# EAGLE design ink_shield_nozzle-test_v3 (EAGLE 6.6.0)
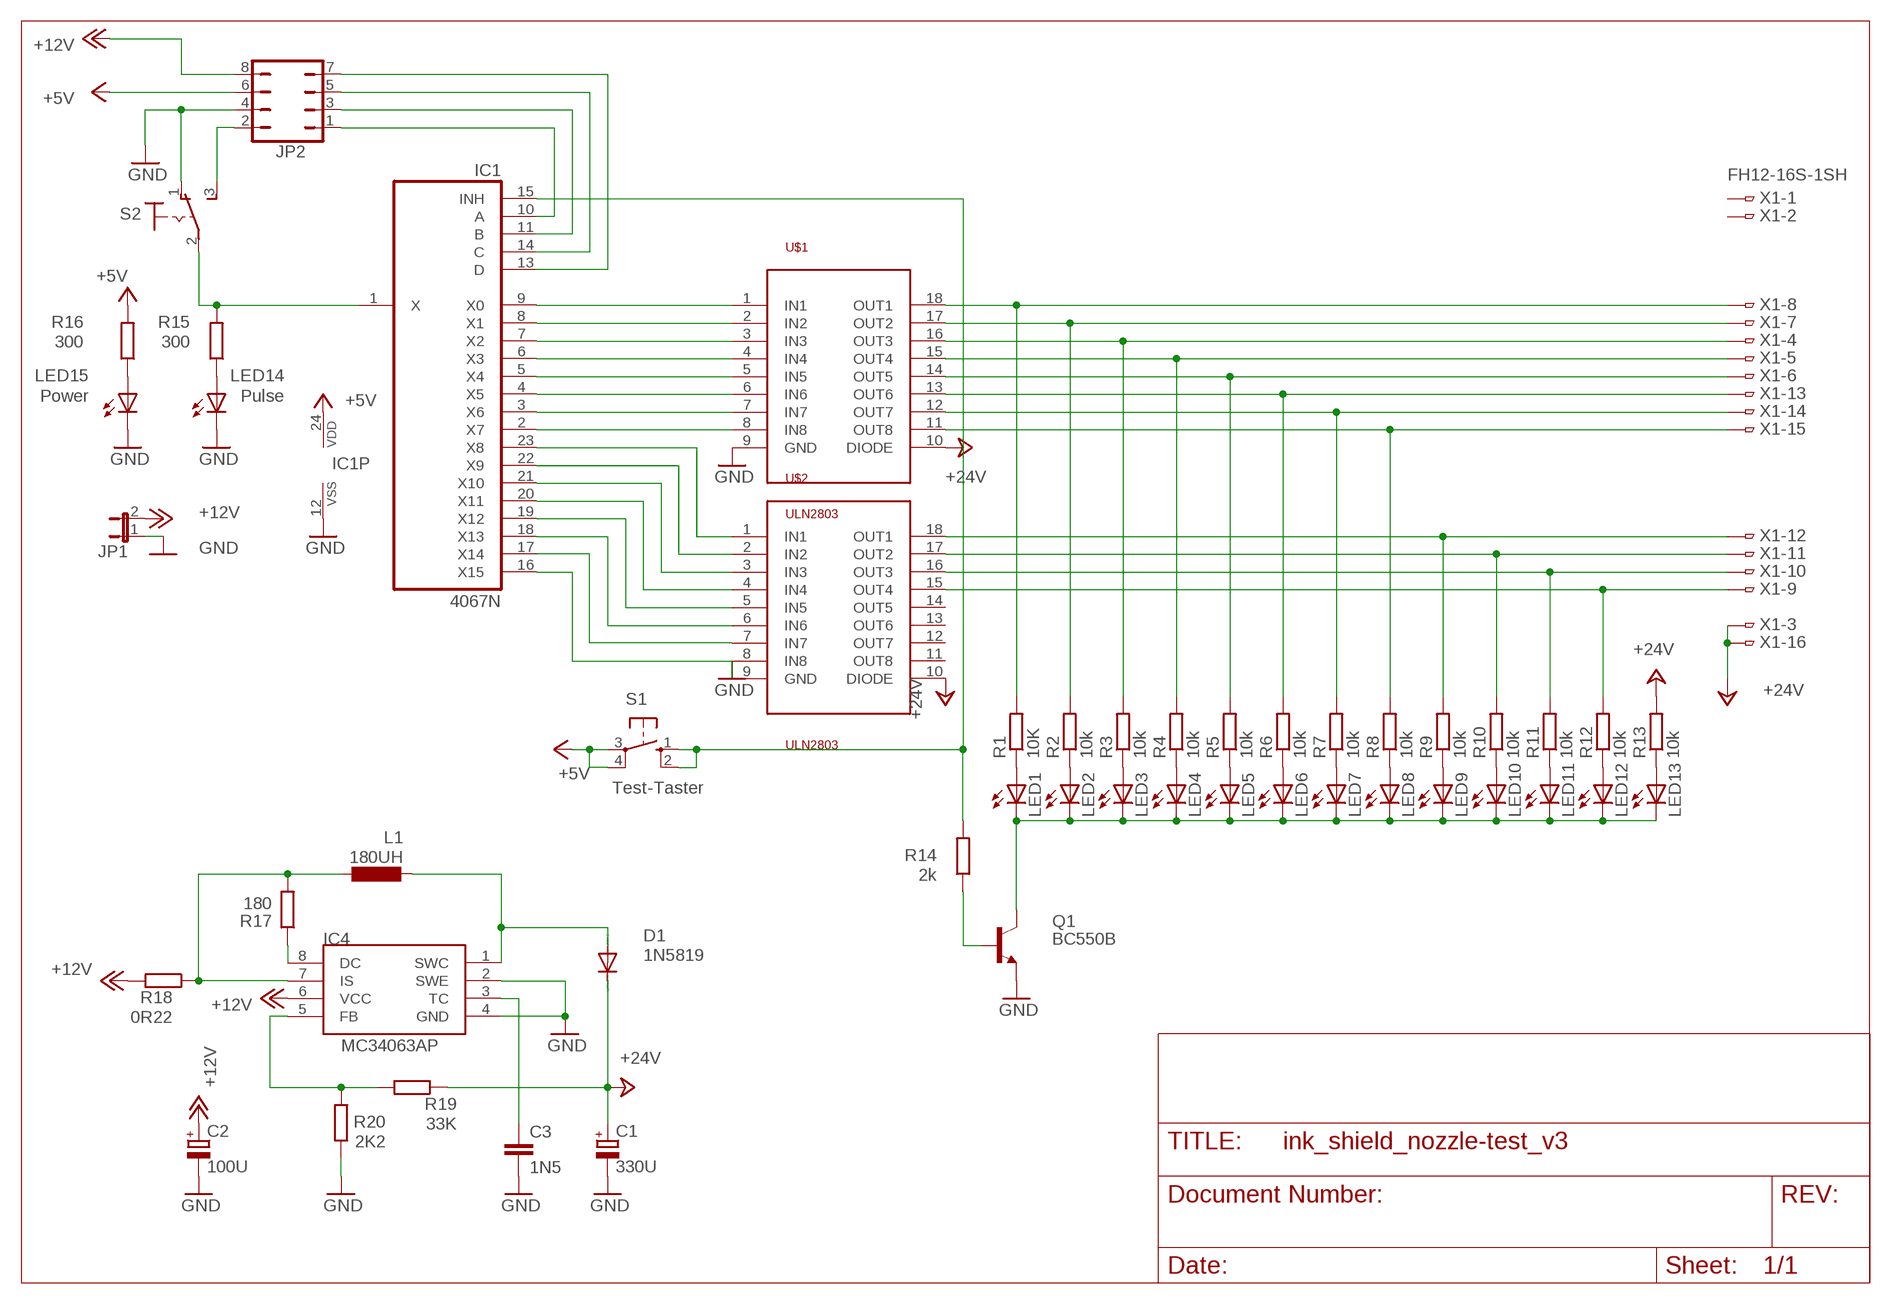
[diagram p0: schematic, sheet 1]

## Parts
C1  330U  CPOL-EUE3.5-10  [E3,5-10]
C2  100U  CPOL-EUE2.5-6  [E2,5-6]
C3  1N5  C-EU025-024X044  [C025-024X044]
D1  1N5819  1N4148DO35-10  [DO35-10]
IC1  4067N  [DIL24-6]
IC4  MC34063AP  [DIL08]
JP1  JP1E  [JP1]
JP2  JP4Q  [JP4Q]
L1  180UH  L-EU6000-XXX-RC  [6000-XXXX-RC]
LED1  LEDCHIPLED_0603  [CHIPLED_0603]
LED2  LEDCHIPLED_0603  [CHIPLED_0603]
LED3  LEDCHIPLED_0603  [CHIPLED_0603]
LED4  LEDCHIPLED_0603  [CHIPLED_0603]
LED5  LEDCHIPLED_0603  [CHIPLED_0603]
LED6  LEDCHIPLED_0603  [CHIPLED_0603]
LED7  LEDCHIPLED_0603  [CHIPLED_0603]
LED8  LEDCHIPLED_0603  [CHIPLED_0603]
LED9  LEDCHIPLED_0603  [CHIPLED_0603]
LED10  LEDCHIPLED_0603  [CHIPLED_0603]
LED11  LEDCHIPLED_0603  [CHIPLED_0603]
LED12  LEDCHIPLED_0603  [CHIPLED_0603]
LED13  LEDCHIPLED_0603  [CHIPLED_0603]
LED14  Pulse  LED3MM  [LED3MM]
LED15  Power  LED3MM  [LED3MM]
Q1  BC550B  [TO92-EBC]
R1  10K  R-EU_M1206  [M1206]
R2  10k  R-EU_M1206  [M1206]
R3  10k  R-EU_M1206  [M1206]
R4  10k  R-EU_M1206  [M1206]
R5  10k  R-EU_M1206  [M1206]
R6  10k  R-EU_M1206  [M1206]
R7  10k  R-EU_M1206  [M1206]
R8  10k  R-EU_M1206  [M1206]
R9  10k  R-EU_M1206  [M1206]
R10  10k  R-EU_M1206  [M1206]
R11  10k  R-EU_M1206  [M1206]
R12  10k  R-EU_M1206  [M1206]
R13  10k  R-EU_M1206  [M1206]
R14  2k  R-EU_M3216  [M3216]
R15  300  R-EU_0207/10  [0207/10]
R16  300  R-EU_0207/10  [0207/10]
R17  180  R-EU_0207/12  [0207/12]
R18  0R22  R-EU_0207/12  [0207/12]
R19  33K  R-EU_0207/12  [0207/12]
R20  2K2  R-EU_0207/10  [0207/10]
S1  Test-Taster  10-XX  [B3F-10XX]
S2  M9040P  [M9040P]
U$1  ULN2803  [SO18L]
U$2  ULN2803  [SO18L]
X1  FH12-16S-1SH  [FH12-16S-1SH]

## Nets
+5V: IC1.24(VDD) JP2.6 R16.2 S1.3(P) S1.4(P1)
+12V: C2.+ IC4.6(VCC) JP1.2 JP2.8 R18.2
+24V: C1.+ D1.C R13.2 R19.1 U$1.10(DIODE) U$2.10(DIODE) X1.3 X1.16
GND: C1.- C2.- C3.2 IC1.12(VSS) IC4.2(SWE) IC4.4(GND) JP1.1 JP2.4 LED14.K(C) LED15.K(C) Q1.E R20.1 S2.1(O) U$1.9(GND) U$2.9(GND)
N$1: IC1.9(X0) U$1.1(IN1)
N$2: IC1.8(X1) U$1.2(IN2)
N$3: IC1.7(X2) U$1.3(IN3)
N$4: IC1.6(X3) U$1.4(IN4)
N$5: IC1.5(X4) U$1.5(IN5)
N$6: IC1.4(X5) U$1.6(IN6)
N$7: IC1.3(X6) U$1.7(IN7)
N$8: IC1.2(X7) U$1.8(IN8)
N$9: IC1.23(X8) U$2.1(IN1)
N$10: IC1.22(X9) U$2.2(IN2)
N$11: IC1.21(X10) U$2.3(IN3)
N$12: IC1.20(X11) U$2.4(IN4)
N$13: IC1.19(X12) U$2.5(IN5)
N$14: IC1.18(X13) U$2.6(IN6)
N$15: IC1.17(X14) U$2.7(IN7)
N$16: IC1.16(X15) U$2.8(IN8)
N$17: LED1.A R1.1
N$18: LED2.A R2.1
N$19: LED3.A R3.1
N$20: LED4.A R4.1
N$21: LED5.A R5.1
N$22: LED6.A R6.1
N$23: LED7.A R7.1
N$24: LED8.A R8.1
N$25: LED9.A R9.1
N$26: LED10.A R10.1
N$27: LED11.A R11.1
N$28: LED12.A R12.1
N$29: LED1.C LED2.C LED3.C LED4.C LED5.C LED6.C LED7.C LED8.C LED9.C LED10.C LED11.C LED12.C LED13.C Q1.C
N$30: R1.2 U$1.18(OUT1) X1.8
N$31: R2.2 U$1.17(OUT2) X1.7
N$32: R3.2 U$1.16(OUT3) X1.4
N$33: R4.2 U$1.15(OUT4) X1.5
N$34: R5.2 U$1.14(OUT5) X1.6
N$35: R6.2 U$1.13(OUT6) X1.13
N$36: R7.2 U$1.12(OUT7) X1.14
N$37: R8.2 U$1.11(OUT8) X1.15
N$38: R9.2 U$2.18(OUT1) X1.12
N$39: R10.2 U$2.17(OUT2) X1.11
N$40: R11.2 U$2.16(OUT3) X1.10
N$41: R12.2 U$2.15(OUT4) X1.9
N$42: LED13.A R13.1
N$43: IC1.15(INH) R14.2 S1.1(S) S1.2(S1)
N$44: Q1.B R14.1
N$45: LED14.A R15.1
N$46: IC1.10(A) JP2.1
N$47: IC1.11(B) JP2.3
N$48: IC1.14(C) JP2.5
N$49: IC1.13(D) JP2.7
N$50: IC1.1(X) R15.2 S2.2(P)
N$51: LED15.A R16.1
N$52: IC4.7(IS) L1.1 R17.2 R18.1
N$53: D1.A IC4.1(SWC) L1.2
N$55: IC4.8(DC) R17.1
N$56: C3.1 IC4.3(TC)
N$57: IC4.5(FB) R19.2 R20.2
N$58: JP2.2 S2.3(S)
Unconnected: U$2.11(OUT8) U$2.12(OUT7) U$2.13(OUT6) U$2.14(OUT5) X1.1 X1.2

## Library data of the parts
C1 C2 = rcl:CPOL-EU: POLARIZED CAPACITOR, European symbol
C3 = rcl:C-EU: CAPACITOR, European symbol
D1 = diode:1N4148: DIODE high speed (Philips)
IC1 = 40xx:4067: 16-channel ANALOG MULTIPLEXER
IC4 = mc34063:MC34063
JP1 = jumper:JP1E: JUMPER
JP2 = jumper:JP4Q: JUMPER
L1 = rcl:L-EU: INDUCTOR, European symbol
LED1-LED15 = led:LED: LED OSRAM: - CHIPLED LG R971, LG N971, LY N971, LG Q971, LY Q971, LO R971, LY R971 LH N974, LH R974 LS Q976, LO Q976, LY Q976 LO Q996 - Hyper CHIPLED LW Q18S LB Q993, LB Q99A, LB R99A - SideLED LS A670, LO A670, LY A670, LG A670, LP A670 LB A673, LV A673, LT A673, LW A673 LH A674 LY A675 LS A676, LA A676, LO A676, LY A676, LW A676 LS A679, LY A679, LG A679 - Hyper Micro SIDELED® LS Y876, LA Y876, LO Y876, LY Y876 LT Y87S - SmartLED LW L88C, LW L88S LB L89C, LB L89S, LG L890 LS L89K, LO L89K, LY L89K LS L896, LA L896, LO L896, LY L896 - TOPLED LS T670, LO T670, LY T670, LG T670, LP T670 LSG T670, LSP T670, LSY T670, LOP T670, LYG T670 LG T671, LOG T671, LSG T671 LB T673, LV T673, LT T673, LW T673 LH T674 LS T676, LA T676, LO T676, LY T676, LB T676, LH T676, LSB T676, LW T676 LB T67C, LV T67C, LT T67C, LS T67K, LO T67K, LY T67K, LW E67C LS E67B, LA E67B, LO E67B, LY E67B, LB E67C, LV E67C, LT E67C LW T67C LS T679, LY T679, LG T679 LS T770, LO T770, LY T770, LG T770, LP T770 LB T773, LV T773, LT T773, LW T773 LH T774 LS E675, LA E675, LY E675, LS T675 LS T776, LA T776, LO T776, LY T776, LB T776 LHGB T686 LT T68C, LB T68C - Hyper Mini TOPLED® LB M676 - Mini TOPLED Santana® LG M470 LS M47K, LO M47K, LY M47K Source: http://www.osram.convergy.de LUXEON: - LUMILED® LXK2-PW12-R00, LXK2-PW12-S00, LXK2-PW14-U00, LXK2-PW14-V00 LXK2-PM12-R00, LXK2-PM12-S00, LXK2-PM14-U00 LXK2-PE12-Q00, LXK2-PE12-R00, LXK2-PE12-S00, LXK2-PE14-T00, LXK2-PE14-U00 LXK2-PB12-K00, LXK2-PB12-L00, LXK2-PB12-M00, LXK2-PB14-N00, LXK2-PB14-P00, LXK2-PB14-Q00 LXK2-PR12-L00, LXK2-PR12-M00, LXK2-PR14-Q00, LXK2-PR14-R00 LXK2-PD12-Q00, LXK2-PD12-R00, LXK2-PD12-S00 LXK2-PH12-R00, LXK2-PH12-S00 LXK2-PL12-P00, LXK2-PL12-Q00, LXK2-PL12-R00 Source: www.luxeon.com KINGBRIGHT: KA-3528ASYC Source: www.kingbright.com
Q1 = transistor-npn:BC550*: NPN Transistor
R1-R20 = rcl:R-EU_: RESISTOR, European symbol
S1 = switch-omron:10-XX: OMRON SWITCH; MPN: B3F-1000; OC_FARNELL: 176432; OC_NEWARK: 36M3542
S2 = switch:M9040P: TOGGLE SWITCH Marquardt
U$1 U$2 = uln2803:ULN2803
X1 = con-hirose:FH12-16S-1S: 1mm Pitch Connectors For FPC/FFC Source: Data sheet <http://www.hirose.co.jp/cataloge_hp/e58605370.pdf>; OC_FARNELL: unknown; OC_NEWARK: unknown

## Board
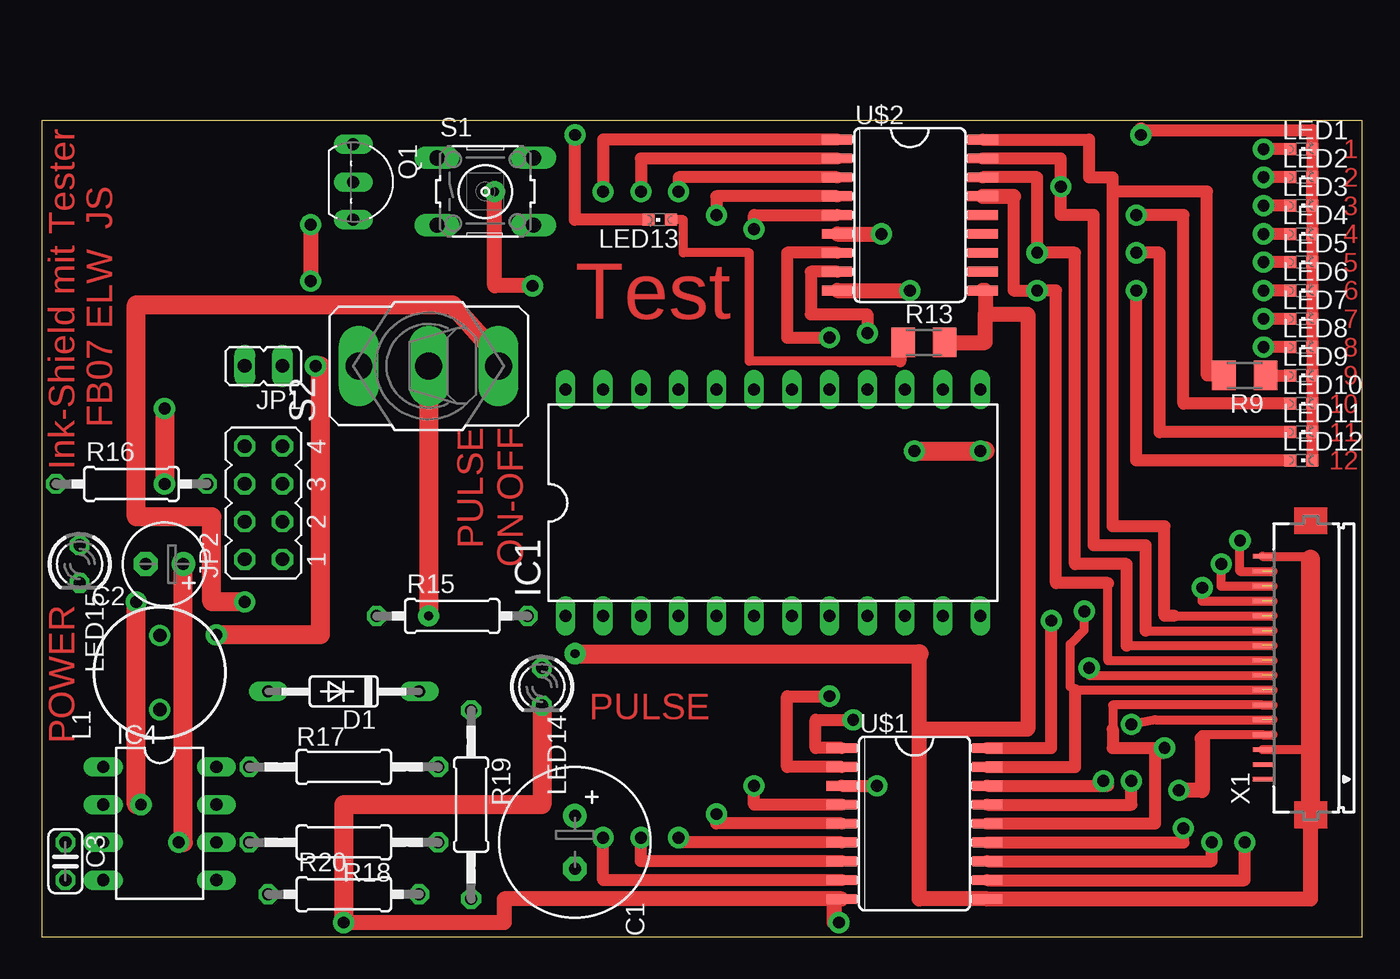
[diagram p1: board, top side]
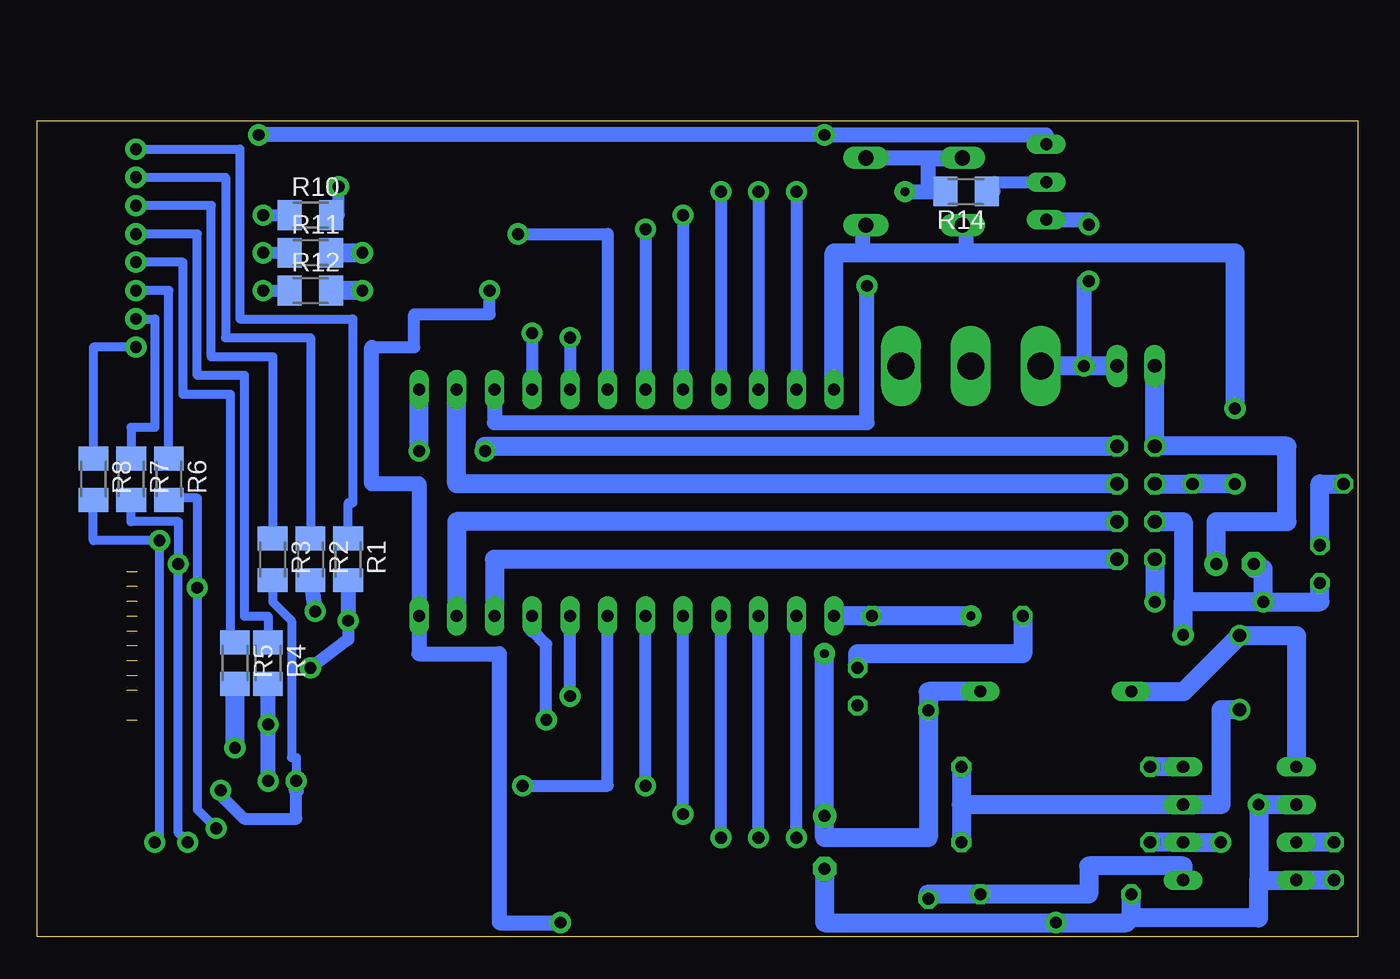
[diagram p2: board, bottom side, seen from below]

Size 88.88 x 54.91 mm. Coordinates in mm from the lower left corner, seen from the top.
Outline: 0,0 88.88,0 88.88,54.91 0,54.91 0,0
Copper layers (1*16): Top 0.035mm / dielectric 1.5mm / Bottom 0.035mm
Design rules "default *": minimum track width 10mil, minimum drill 10mil, track to track 8mil, track to pad 8mil, pad to pad 8mil, via to via 8mil, smd to smd 8mil, copper to edge 40mil, drill to drill 8mil, minimum pad ring 10mil, minimum via ring 8mil, stop-mask expansion 4mil, vias tented up to drill 0mil, thermal gap 10mil

### Footprints (pad centres in the part's own frame; a part is rotated, then mirrored left to right if it is on the bottom)
E3,5-10 = drill 0.813 pad 1.6: + -1.778,0 | drill 0.813 pad 1.6 octagon: - 1.778,0
E2,5-6 = drill 0.813 pad 1.6: + -1.27,0 | drill 0.813 pad 1.6 octagon: - 1.27,0
C025-024X044 = drill 0.813 octagon: 1 -1.27,0; 2 1.27,0
DO35-10 = drill 0.813 long: A 5.08,0; C -5.08,0
DIL24-6 = drill 0.813 long: 1 -13.97,-7.62; 2 -11.43,-7.62; 3 -8.89,-7.62; 4 -6.35,-7.62; 5 -3.81,-7.62; 6 -1.27,-7.62; 7 1.27,-7.62; 8 3.81,-7.62; 9 6.35,-7.62; 10 8.89,-7.62; 11 11.43,-7.62; 12 13.97,-7.62; 13 13.97,7.62; 14 11.43,7.62; 15 8.89,7.62; 16 6.35,7.62; 17 3.81,7.62; 18 1.27,7.62; 19 -1.27,7.62; 20 -3.81,7.62; 21 -6.35,7.62; 22 -8.89,7.62; 23 -11.43,7.62; 24 -13.97,7.62
DIL08 = drill 0.813 long: 1 -3.81,-3.81; 2 -1.27,-3.81; 3 1.27,-3.81; 4 3.81,-3.81; 5 3.81,3.81; 6 1.27,3.81; 7 -1.27,3.81; 8 -3.81,3.81
JP1 = drill 0.914 long: 1 0,-1.27; 2 0,1.27
JP4Q = drill 0.914 octagon: 1 -3.81,-1.27; 2 -3.81,1.27; 3 -1.27,-1.27; 4 -1.27,1.27; 5 1.27,-1.27; 6 1.27,1.27; 7 3.81,-1.27; 8 3.81,1.27
6000-XXXX-RC = drill 0.9 pad 1.422: 1 -2.5,0; 2 2.5,0
CHIPLED_0603 = smd 0.8 x 0.8: A 0,-0.75; C 0,0.75
LED3MM = drill 0.813 octagon: A -1.27,0; K 1.27,0
TO92-EBC = drill 0.813 long: B 0,-1.27; C -2.54,-1.27; E 2.54,-1.27
M1206 = smd 1.6 x 2: 1 -1.4,0; 2 1.4,0
M3216 = smd 1.6 x 2: 1 -1.4,0; 2 1.4,0
0207/10 = drill 0.813 octagon: 1 -5.08,0; 2 5.08,0
0207/12 = drill 0.813 octagon: 1 -6.35,0; 2 6.35,0
B3F-10XX = drill 1.016 long: 1 -3.251,2.261; 2 3.251,2.261; 3 -3.251,-2.261; 4 3.251,-2.261
M9040P = drill 1.803 long: 1 0,4.699; 2 0,0; 3 0,-4.699
SO18L = smd 0.66 x 2.032: 1 -5.08,-4.902; 2 -3.81,-4.902; 3 -2.54,-4.902; 4 -1.27,-4.902; 5 0,-4.902; 6 1.27,-4.902; 7 2.54,-4.902; 8 3.81,-4.902; 9 5.08,-4.902; 10 5.08,4.902; 11 3.81,4.902; 12 2.54,4.902; 13 1.27,4.902; 14 0,4.902; 15 -1.27,4.902; 16 -2.54,4.902; 17 -3.81,4.902; 18 -5.08,4.902
FH12-16S-1SH = smd 0.3 x 1.3: 1 -7.5,3.25; 2 -6.5,3.25; 3 -5.5,3.25; 4 -4.5,3.25; 5 -3.5,3.25; 6 -2.5,3.25; 7 -1.5,3.25; 8 -0.5,3.25; 9 0.5,3.25; 10 1.5,3.25; 11 2.5,3.25; 12 3.5,3.25; 13 4.5,3.25; 14 5.5,3.25; 15 6.5,3.25; 16 7.5,3.25

### Placement (x,y rotation side)
C1  35.88,6.35 270 top
C2  8.26,25.08 180 top
C3  1.59,5.08 270 top
D1  20.32,16.51 180 top
IC1  49.21,29.21 0 top
IC4  7.94,7.62 270 top
JP1  14.92,38.42 90 top
JP2  14.92,29.21 90 top
L1  7.94,17.78 90 top
LED1  84.77,53.02 270 top
LED2  84.77,51.12 270 top
LED3  84.77,49.21 270 top
LED4  84.77,47.31 270 top
LED5  84.77,45.4 270 top
LED6  84.77,43.5 270 top
LED7  84.77,41.59 270 top
LED8  84.77,39.69 270 top
LED9  84.77,37.78 270 top
LED10  84.77,35.88 270 top
LED11  84.77,33.97 270 top
LED12  84.77,32.07 270 top
LED13  41.59,48.26 90 top
LED14  33.66,16.83 270 top
LED15  2.54,25.08 270 top
Q1  22.23,50.8 270 top
R1  67.94,25.4 270 bottom
R2  70.48,25.4 270 bottom
R3  73.03,25.4 270 bottom
R4  73.34,18.41 270 bottom
R5  75.56,18.41 270 bottom
R6  80.01,30.8 270 bottom
R7  82.55,30.8 270 bottom
R8  85.09,30.8 270 bottom
R9  80.96,37.78 180 top
R10  70.48,48.58 0 bottom
R11  70.48,46.04 0 bottom
R12  70.48,43.5 0 bottom
R13  59.37,40.01 0 top
R14  26.35,50.16 180 bottom
R15  27.62,21.59 0 top
R16  6.03,30.48 0 top
R17  20.32,11.43 0 top
R18  20.32,6.35 180 top
R19  28.89,8.89 270 top
R20  20.32,2.86 0 top
S1  29.84,50.16 0 top
S2  26.04,38.42 90 top
U$1  58.74,7.62 270 top
U$2  58.42,48.58 270 top
X1  85.41,18.1 90 top

### Tracks (layer width: path | path; a pad name or v marks a point on that pad's centre or on a via)
+5V  (via drill 0.8 pad 1.42)
  Top 1.27: v8.26,35.56 v8.26,30.48
  Bottom 1.016: S1.3 26.35,47.9 26.35,46.04 | S1.4 33.34,47.9 33.34,46.04
  Bottom 1.27: JP2.6 R16.2 v8.26,30.48 | IC1.24 35.24,46.04 33.34,46.04 26.35,46.04 8.26,46.04 v8.26,35.56
+12V  (via drill 0.8 pad 1.42)
  Top 1.27: v9.21,6.35 9.53,6.35 C2.+
  Bottom 1.27: R18.2 IC4.6 v9.21,6.35 | C2.+ 9.53,27.94 4.76,27.94 4.76,33.02 JP2.8 JP1.2
+24V  (via drill 0.6 pad 1.42)
  Top 0.61: X1.16 85.41,25.6 85.41,25.4 | X1.3 85.41,12.6 85.41,12.7
  Top 1.016: 85.41,7.62 85.41,2.54 U$1.10 59.05,2.54 59.05,13.97 | 59.05,13.97 59.05,19.05 | U$2.10 63.5,43.5 63.5,41.91 | 63.5,41.91 66.36,41.91 66.36,13.97 59.05,13.97 | R13.2 63.5,40.01 63.5,41.91
  Top 1.27: 85.41,7.62 85.41,12.7 85.41,25.4 | v35.88,19.05 59.05,19.05
  Bottom 1.27: D1.C 28.89,16.51 R19.1 28.89,6.67 35.88,6.67 C1.+ v35.88,19.05
GND  (via drill 0.8 pad 1.42)
  Top 1.016: U$1.9 53.34,2.54 | 53.34,2.54 31.11,2.54 31.11,0.95 v20.32,0.95 | v53.66,0.95 53.34,0.95 53.34,2.54 | U$2.9 v58.42,43.5 | v18.1,47.94 v18.1,44.13
  Top 1.27: v6.67,8.89 6.35,8.89 v6.35,22.54 | v18.41,38.42 18.73,38.42 18.73,20.32 v11.75,20.32 | LED14.K 33.66,8.89 20.32,8.89 v20.32,0.95
  Bottom 0.813: 66.36,39.69 63.5,39.69 63.5,41.91 58.42,41.91 v58.42,43.5
  Bottom 1.016: v53.66,0.95 57.78,0.95 57.78,19.05 63.18,19.05 IC1.12 63.18,30.48 66.36,30.48 66.36,39.69 | Q1.E 18.1,48.26 v18.1,47.94 | v18.1,44.13 18.41,44.13 v18.41,38.42
  Bottom 1.27: 6.67,3.81 v6.67,8.89 IC4.2 | 6.67,3.81 IC4.4 C3.2 | 6.67,3.81 6.67,1.27 15.24,1.27 | C1.- 35.88,0.95 v20.32,0.95 15.56,0.95 15.24,1.27 | 15.24,1.27 R20.1 | v6.35,22.54 11.75,22.54 | v6.35,22.54 2.54,22.54 LED15.K | v6.35,22.54 6.35,24.77 6.99,24.77 C2.- | JP2.4 11.75,27.94 11.75,22.54 | S2.1 v18.41,38.42 JP1.1 | v11.75,20.32 11.75,22.54
N$1  (via drill 0.8 pad 1.42)
  Top 0.813: U$1.1 52.07,12.7 52.07,14.61 v54.61,14.61
  Bottom 0.813: v54.61,14.61 54.61,19.68 55.56,20.64
  Bottom 1.016: 55.56,20.64 IC1.9
N$2  (via drill 0.8 pad 1.42)
  Top 0.813: U$1.2 50.16,11.43 50.16,16.19 v53.02,16.19
  Bottom 0.813: v53.02,16.19 IC1.8
N$3  (via drill 0.8 pad 1.42)
  Top 0.813: U$1.3 v56.2,10.16
  Bottom 0.813: v56.2,10.16 50.48,10.16 IC1.7
N$4  (via drill 0.8 pad 1.42)
  Top 0.813: U$1.4 47.94,8.89 v47.94,10.16
  Bottom 0.813: v47.94,10.16 IC1.6
N$5  (via drill 0.8 pad 1.42)
  Top 0.813: U$1.5 45.4,7.62 v45.4,8.26
  Bottom 0.813: v45.4,8.26 IC1.5
N$6  (via drill 0.8 pad 1.42)
  Top 0.813: U$1.6 42.86,6.35 v42.86,6.67
  Bottom 0.813: v42.86,6.67 IC1.4
N$7  (via drill 0.8 pad 1.42)
  Top 0.813: U$1.7 40.32,5.08 v40.32,6.67
  Bottom 0.813: v40.32,6.67 IC1.3
N$8  (via drill 0.8 pad 1.42)
  Top 0.813: U$1.8 37.78,3.81 v37.78,6.67
  Bottom 0.813: v37.78,6.67 IC1.2
N$9  (via drill 0.8 pad 1.42)
  Top 0.813: U$2.1 37.78,53.66 v37.78,50.16
  Bottom 0.813: v37.78,50.16 IC1.23
N$10  (via drill 0.8 pad 1.42)
  Top 0.813: U$2.2 40.32,52.39 v40.32,50.16
  Bottom 0.813: v40.32,50.16 IC1.22
N$11  (via drill 0.8 pad 1.42)
  Top 0.813: U$2.3 42.86,51.12 v42.86,50.16
  Bottom 0.813: v42.86,50.16 IC1.21
N$12  (via drill 0.8 pad 1.42)
  Top 0.813: U$2.4 45.4,49.85 v45.4,48.58
  Bottom 0.813: v45.4,48.58 IC1.20
N$13  (via drill 0.8 pad 1.42)
  Top 0.813: v47.94,47.62 47.94,48.58 U$2.5
  Bottom 0.813: v47.94,47.62 IC1.19
N$14  (via drill 0.8 pad 1.42)
  Top 1.016: U$2.6 v56.52,47.31
  Bottom 0.813: v56.52,47.31 50.48,47.31 IC1.18
N$15  (via drill 0.8 pad 1.42)
  Top 0.813: U$2.7 50.16,46.04 50.16,40.32 v53.02,40.32
  Bottom 0.813: v53.02,40.32 IC1.17
N$16  (via drill 0.8 pad 1.42)
  Top 0.813: U$2.8 51.75,44.77 51.75,41.91 55.56,41.91 v55.56,40.64
  Bottom 0.813: v55.56,40.64 IC1.16
N$17  (via drill 0.8 pad 1.42)
  Top 0.813: LED1.A v82.23,53.02
  Bottom 0.61: R1.1 67.94,29.21 67.63,29.21 67.63,41.59 75.25,41.59 75.25,53.02 v82.23,53.02
N$18  (via drill 0.8 pad 1.42)
  Top 0.813: LED2.A v82.23,51.12
  Bottom 0.61: R2.1 70.48,40.32 76.2,40.32 76.2,51.12 v82.23,51.12
N$19  (via drill 0.8 pad 1.42)
  Top 0.813: LED3.A v82.23,49.21
  Bottom 0.61: R3.1 73.03,39.05 77.15,39.05 77.15,49.21 v82.23,49.21
N$20  (via drill 0.8 pad 1.42)
  Top 0.813: LED4.A v82.23,47.31
  Bottom 0.61: R4.1 73.34,21.59 74.93,21.59 74.93,37.78 78.11,37.78 78.11,47.31 v82.23,47.31
N$21  (via drill 0.8 pad 1.42)
  Top 0.813: LED5.A v82.23,45.4
  Bottom 0.61: R5.1 75.56,19.68 75.88,19.68 75.88,36.51 79.06,36.51 79.06,45.4 v82.23,45.4
N$22  (via drill 0.8 pad 1.42)
  Top 0.813: LED6.A v82.23,43.5
  Bottom 0.61: R6.1 80.01,43.5 v82.23,43.5
N$23  (via drill 0.8 pad 1.42)
  Top 0.813: LED7.A v82.23,41.59
  Bottom 0.61: v82.23,41.59 80.96,41.59 80.96,34.29 82.55,34.29 R7.1
N$24  (via drill 0.8 pad 1.42)
  Top 0.813: LED8.A v82.23,39.69
  Bottom 0.61: v82.23,39.69 85.09,39.69 R8.1
N$25
  Top 0.813: R9.1 LED9.A
N$26  (via drill 0.8 pad 1.42)
  Top 0.813: LED10.A 76.83,35.88 76.83,48.58 v73.66,48.58
  Bottom 0.813: v73.66,48.58 R10.1
N$27  (via drill 0.8 pad 1.42)
  Top 0.813: LED11.A 75.25,33.97 75.25,46.04 v73.66,46.04
  Bottom 0.813: v73.66,46.04 R11.1
N$28  (via drill 0.8 pad 1.42)
  Top 0.813: LED12.A 73.66,32.07 v73.66,43.5
  Bottom 0.813: v73.66,43.5 R12.1
N$29  (via drill 0.8 pad 1.42)
  Top 0.813: LED12.C LED11.C LED10.C LED9.C LED8.C LED7.C LED6.C LED5.C LED4.C LED3.C LED2.C LED1.C 85.52,54.29 73.98,54.29 | LED13.C 35.88,48.26 v35.88,53.98
  Top 1.016: v73.98,53.98 73.98,54.29
  Bottom 1.016: Q1.C 20.95,53.98 v35.88,53.98 v73.98,53.98
N$30  (via drill 0.8 pad 1.42)  (1 unrouted)
  Top 0.61: 82.87,17.6 70.48,17.6 v70.48,18.1
  Top 0.813: U$1.18 67.94,12.7 v67.94,21.27
  Bottom 0.813: v67.94,21.27 67.94,20 v70.48,18.1
  Bottom 1.016: R1.2 v67.94,21.27
N$31  (via drill 0.8 pad 1.42)  (1 unrouted)
  Top 0.61: 82.87,16.6 69.53,16.6 69.3,16.83 69.22,16.83 69.22,19.68 70.17,20.64 v70.17,21.91
  Top 0.813: U$1.17 69.53,11.43 69.53,16.6
  Bottom 1.016: R2.2 v70.17,21.91
N$32  (via drill 0.8 pad 1.42)
  Top 0.61: 82.87,13.6 X1.4 78.11,13.6 78.11,13.34
  Top 0.813: U$1.16 71.75,10.16 v71.44,10.48
  Top 1.016: 78.11,13.34 78.11,9.84 v76.52,9.84
  Bottom 0.61: R3.2 73.03,22.54 71.75,21.27 71.75,12.06 71.44,12.06 v71.44,10.48
  Bottom 0.813: v76.52,9.84 76.52,9.53 74.93,7.94 71.44,7.94 71.44,9.84
  Bottom 1.016: 71.44,9.84 v71.44,10.48
N$33  (via drill 0.8 pad 1.42)  (1 unrouted)
  Top 0.61: v73.34,14.29 74.94,14.6 82.87,14.6 82.87,14.61
  Top 0.813: U$1.15 73.34,8.89 v73.34,10.48
  Bottom 1.016: v73.34,10.48 v73.34,14.29 R4.2
N$34  (via drill 0.8 pad 1.42)
  Top 0.61: 82.87,15.6 X1.6 72.07,15.6 72.07,13.97
  Top 0.813: 72.07,13.97 72.07,12.7 v75.56,12.7 75.56,12.38 74.93,12.38 74.93,7.62 U$1.14
  Bottom 1.27: v75.56,12.7 R5.2
N$35  (via drill 0.8 pad 1.42)  (1 unrouted)
  Top 0.61: 82.87,22.6 78.11,22.6 v78.11,23.5
  Top 0.813: U$1.13 76.83,6.35 v76.83,7.3
  Bottom 0.61: v76.83,7.3 78.11,8.57 v78.11,23.5 78.11,29.53 80.01,29.53 R6.2
N$36  (via drill 0.8 pad 1.42)  (1 unrouted)
  Top 0.61: v79.38,25.08 79.38,23.6 82.87,23.6
  Top 0.813: U$1.12 78.74,5.08 v78.74,6.35
  Bottom 0.61: v78.74,6.35 79.38,6.99 v79.38,25.08 79.38,27.94 82.55,27.94 R7.2
N$37  (via drill 0.8 pad 1.42)  (1 unrouted)
  Top 0.61: 82.87,24.6 80.64,24.6 v80.64,26.67
  Top 0.813: U$1.11 80.96,3.81 v80.96,6.35
  Bottom 0.61: v80.96,6.35 80.64,6.67 v80.64,26.67 85.09,26.67 R8.2
N$38  (1 unrouted)
  Top 0.61: 76.2,21.6 82.87,21.6
  Top 0.813: U$2.18 70.48,53.66 70.48,51.12 72.07,51.12 72.07,50.48 72.07,50.16 | 76.2,21.6 75.56,21.6 75.56,27.62 72.07,27.62 72.07,50.16 | R9.2 78.42,37.78 78.42,50.16 72.07,50.16
N$39  (via drill 0.8 pad 1.42)  (1 unrouted)
  Top 0.61: 74.3,20.6 82.87,20.6
  Top 0.813: U$2.17 68.58,52.39 v68.58,50.48 68.58,48.58 70.8,48.58 70.8,26.35 74.3,26.35 74.3,20.6
  Bottom 0.813: R10.2 68.58,48.58 v68.58,50.48
N$40  (via drill 0.8 pad 1.42)  (1 unrouted)
  Top 0.61: 73.03,19.6 82.87,19.6
  Top 0.813: U$2.16 66.99,51.12 v66.99,46.04 69.53,46.04 69.53,25.08 73.03,25.08 73.03,19.6
  Bottom 1.27: R11.2 v66.99,46.04
N$41  (via drill 0.8 pad 1.42)  (1 unrouted)
  Top 0.61: 82.87,18.6 71.75,18.6 71.75,23.81
  Top 0.813: 65.41,49.85 65.41,43.5 v66.99,43.5 68.26,43.5 68.26,23.81 71.75,23.81
  Top 1.016: U$2.15 65.41,49.85
  Bottom 1.27: v66.99,43.5 R12.2
N$42
  Top 0.61: 57.78,38.73 47.62,38.73 47.62,46.04 43.18,46.04 43.18,48.26 LED13.A
  Top 0.813: R13.1 57.78,40.01 57.78,38.73
N$43  (via drill 0.6 pad 1.42, 0.8 pad 1.42)
  Top 1.016: v33.02,43.81 30.48,43.81 v30.48,50.16
  Bottom 1.016: IC1.15 58.1,34.61 33.02,34.61 v33.02,43.81 | v30.48,50.16 R14.2 28.89,50.16 28.89,52.39 27.86,52.39 S1.1 S1.2
N$44
  Bottom 0.813: R14.1 24.45,50.16 24.45,50.8 Q1.B
N$45
  Bottom 1.27: R15.1 22.54,19.05 33.66,19.05 LED14.A
N$46
  Bottom 1.27: JP2.1 58.1,25.4 IC1.10
N$47
  Bottom 1.27: JP2.3 60.64,27.94 IC1.11
N$48
  Bottom 1.27: JP2.5 60.64,30.48 IC1.14
N$49  (via drill 0.8 pad 1.42)
  Top 1.27: v58.74,32.7 v63.18,32.7 63.5,32.7
  Bottom 1.27: v63.18,32.7 IC1.13 | v58.74,32.7 58.74,33.02 JP2.7
N$50  (via drill 0.6 pad 1.42)
  Top 1.27: S2.2 v26.04,21.59
  Bottom 1.27: v26.04,21.59 R15.2 IC1.1
N$51
  Bottom 1.27: LED15.A 2.54,30.48 R16.1
N$52
  Bottom 1.27: R17.2 26.67,8.89 | 26.67,8.89 R18.1 | 26.67,8.89 IC4.7 9.21,8.89 9.21,15.28 L1.1
N$53
  Bottom 1.27: IC4.1 4.13,20.28 L1.2 11.71,16.51 D1.A
N$55
  Bottom 1.27: IC4.8 R17.1
N$56
  Bottom 1.27: C3.1 IC4.3
N$57
  Bottom 1.27: R19.2 28.89,2.86 R20.2 18.1,2.86 18.1,4.76 11.75,4.76 IC4.5
N$58  (via drill 0.8 pad 1.42)
  Top 1.27: v13.65,22.54 11.43,22.54 11.43,28.26 6.35,28.26 6.35,42.55 27.62,42.55 30.16,39.69 S2.3
  Bottom 1.27: JP2.2 v13.65,22.54

### Text on the board
Top: 1 / 2 / 3 / 4 / 5 / 6 / 7 / 8 / 9 / 10 / 11 / 12 | JS | Test | FB07 ELW | PULSE / ON-OFF | Ink-Shield mit Tester | PULSE | POWER